# Altium schematic sheet 0.SchDoc
size A4
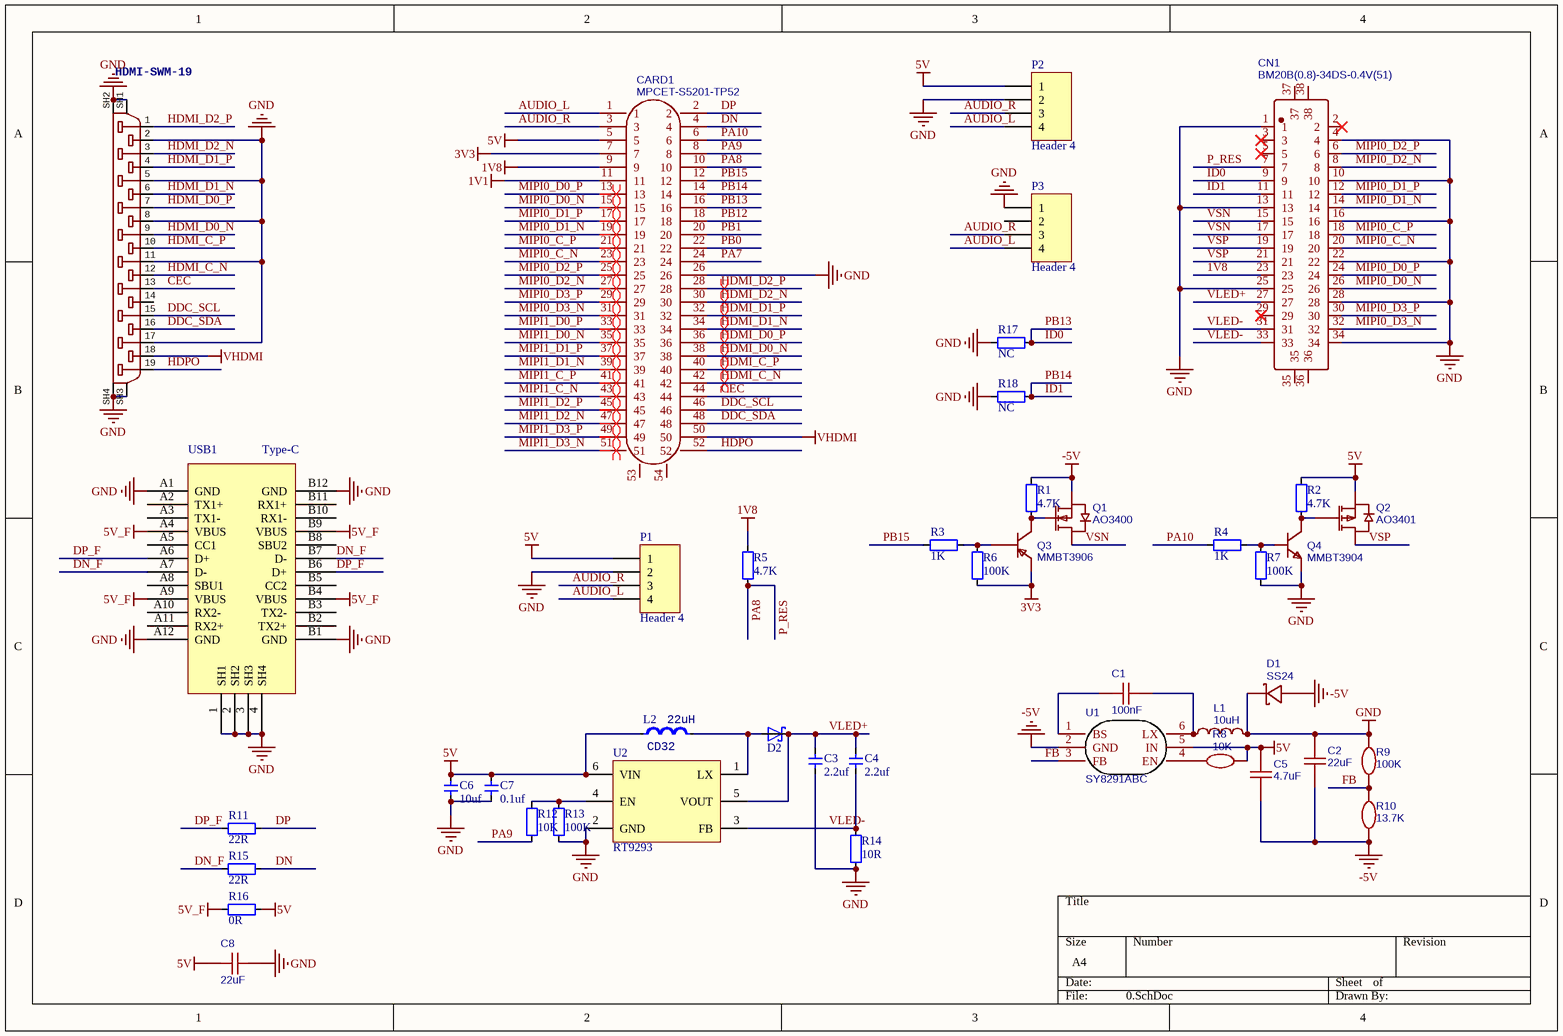
[diagram p0: 0.SchDoc]

## Parts
C1  100nF  [0603_CAP]
C2  22uF  [0603_CAP]
C3  2.2uf  [0603_CAP]
C4  2.2uf  [0603_CAP]
C5  4.7uF  [0603_CAP]
C6  10uf  [0603_CAP]
C7  0.1uf  [0603_CAP]
C8  22uF  [0603_CAP]
CARD1  MPCET-S5201-TP52  [MINI-PCIE-SMD_MPCET-S5201-TP40]
CN1  BM20B(0.8)-34DS-0.4V(51)  [CONN-SMD_34P-P0.40_BM20B-0.8-34DS-0.4V-51]
D1  SS24  [SMA_L4.4-W2.8-LS5.4-RD]
D2  RSX501L-20  [SOD-123F_L2.8-W1.8-LS3.7-RD]  (value not drawn)
HDMI?  HDMI-SWM-19  [HDMI-SWM-19]
L1  10uH  [IND-SMD_L4.5-W4.5_SMMS0420]
L2  value 22uH  [IND_CD32]  (hidden comment: CD32)
P1  Header 4  [HDR1X4]
P2  Header 4  [HDR1X4]
P3  Header 4  [PJ-320D 3.5]
Q1  AO3400  [SOT-23-3]
Q2  AO3401  [SOT-23-3]
Q3  MMBT3906  [SOT-23-3]
Q4  MMBT3904  [SOT-23-3]
R1  4.7K  [0603_RES]
R2  4.7K  [0603_RES]
R3  1K  [0603_RES]
R4  1K  [0603_RES]
R5  4.7K  [0603_RES]
R6  100K  [0603_RES]
R7  100K  [0603_RES]
R8  10K  [0603_RES]
R9  100K  [0603_RES]
R10  13.7K  [0603_RES]
R11  22R  [0603_RES]
R12  10K  [0603_RES]
R13  100K  [0603_RES]
R14  10R  [0603_RES]
R15  22R  [0603_RES]
R16  0R  [0603_RES]
R17  NC  [0603_RES]
R18  NC  [0603_RES]
U1  SY8291ABC  [SOT-23-6_L2.9-W1.6-P0.95-LS2.8-BR]
U2  RT9293  [SOT23-6]
USB1  Type-C  [Type-C-TOP]

## Nets
1V1: CARD1.11
1V8: CARD1.9 CN1.23 R5.1
3V3: CARD1.7 Q3.2(E) R6.1
5V: C5.1 C6.2 C7.2 C8.1 CARD1.5 L2.1 P1.1 P2.1 Q2.2(S) R2.2 R8.2 R16.2 U1.5(IN) U2.6(VIN)
5V_F: R16.1 USB1.A4(VBUS) USB1.A9(VBUS) USB1.B4(VBUS) USB1.B9(VBUS)
-5V: C2.2 C5.2 D1.2(A) Q1.2(S) R1.2 R10.1 U1.2(GND)
GND: C2.1 C3.1 C6.1 C7.1 C8.2 CARD1.26 CN1.1 CN1.4 CN1.10 CN1.13 CN1.16 CN1.22 CN1.25 CN1.28 CN1.34 D1.1(K) HDMI?.2 HDMI?.5 HDMI?.8 HDMI?.11 HDMI?.17 HDMI?.SH1 HDMI?.SH2 HDMI?.SH3 HDMI?.SH4 L1.2 P1.2 P2.2 P3.1 Q4.2(E) R7.1 R9.2 R13.2 R14.2 R17.2 R18.2 U2.2(GND) USB1.1(SH1) USB1.2(SH2) USB1.3(SH3) USB1.4(SH4) USB1.A1(GND) USB1.A12(GND) USB1.B1(GND) USB1.B12(GND)
VHDMI: CARD1.50 HDMI?.18
AUDIO_L: CARD1.1 P1.4 P2.4 P3.4
AUDIO_R: CARD1.3 P1.3 P2.3 P3.3
CEC: CARD1.44 HDMI?.13
DDC_SCL: CARD1.46 HDMI?.15
DDC_SDA: CARD1.48 HDMI?.16
DN: CARD1.4 R15.2
DN_F: R15.1 USB1.A7(D-) USB1.B7(D-)
DP: CARD1.2 R11.2
DP_F: R11.1 USB1.A6(D+) USB1.B6(D+)
FB: R9.1 R10.2 U1.3(FB)
HDMI_C_N: CARD1.42 HDMI?.12
HDMI_C_P: CARD1.40 HDMI?.10
HDMI_D0_N: CARD1.38 HDMI?.9
HDMI_D0_P: CARD1.36 HDMI?.7
HDMI_D1_N: CARD1.34 HDMI?.6
HDMI_D1_P: CARD1.32 HDMI?.4
HDMI_D2_N: CARD1.30 HDMI?.3
HDMI_D2_P: CARD1.28 HDMI?.1
HDPO: CARD1.52 HDMI?.19
ID0: CARD1.16 CN1.9 R17.1  [also labelled PB13]
ID1: CARD1.14 CN1.11 R18.1  [also labelled PB14]
MIPI0_C_N: CARD1.23 CN1.20
MIPI0_C_P: CARD1.21 CN1.18
MIPI0_D0_N: CARD1.15 CN1.26
MIPI0_D0_P: CARD1.13 CN1.24
MIPI0_D1_N: CARD1.19 CN1.14
MIPI0_D1_P: CARD1.17 CN1.12
MIPI0_D2_N: CARD1.27 CN1.8
MIPI0_D2_P: CARD1.25 CN1.6
MIPI0_D3_N: CARD1.31 CN1.32
MIPI0_D3_P: CARD1.29 CN1.30
MIPI1_C_N: CARD1.43
MIPI1_C_P: CARD1.41
MIPI1_D0_N: CARD1.35
MIPI1_D0_P: CARD1.33
MIPI1_D1_N: CARD1.39
MIPI1_D1_P: CARD1.37
MIPI1_D2_N: CARD1.47
MIPI1_D2_P: CARD1.45
MIPI1_D3_N: CARD1.51
MIPI1_D3_P: CARD1.49
P_RES: CARD1.10 CN1.7 R5.2  [also labelled PA8]
PA7: CARD1.24
PA9: CARD1.8 R12.2
PA10: CARD1.6 R4.2
PB0: CARD1.22
PB1: CARD1.20
PB12: CARD1.18
PB15: CARD1.12 R3.2
VLED+: C3.2 C4.2 CN1.27 D2.1 U2.5(VOUT)
VLED-: C4.1 CN1.31 CN1.33 R14.1 U2.3(FB)
VSN: CN1.15 CN1.17 Q1.3(D)
VSP: CN1.19 CN1.21 Q2.3(D)
NetC1_1: C1.1 L1.1 U1.6(LX)
NetC1_2: C1.2 U1.1(BS)
NetD2_2: D2.2 L2.2 U2.1(LX)
NetQ1_1: Q1.1(G) Q3.3(C) R1.1
NetQ2_1: Q2.1(G) Q4.3(C) R2.1
NetQ3_1: Q3.1(B) R3.1 R6.2
NetQ4_1: Q4.1(B) R4.1 R7.2
NetR8_1: R8.1 U1.4(EN)
NetR12_1: R12.1 R13.1 U2.4(EN)

Not connected (* = marked no-connect by the designer): CARD1 53 54; CN1 2* 3* 5* 29* 35 36 37 38; HDMI? 14; P3 2; USB1 A2(TX1+) A3(TX1-) A5(CC1) A8(SBU1) A10(RX2-) A11(RX2+) B2(TX2+) B3(TX2-) B5(CC2) B8(SBU2) B10(RX1-) B11(RX1+)

## Layout directives
differential pair: HDMI_C_N, HDMI_C_P, HDMI_D0_N, HDMI_D0_P, HDMI_D1_N, HDMI_D1_P, HDMI_D2_N, HDMI_D2_P, MIPI0_C_N, MIPI0_C_P, MIPI0_D0_N, MIPI0_D0_P, MIPI0_D1_N, MIPI0_D1_P, MIPI0_D2_N, MIPI0_D2_P, MIPI0_D3_N, MIPI0_D3_P, MIPI1_C_N, MIPI1_C_P, MIPI1_D0_N, MIPI1_D0_P, MIPI1_D1_N, MIPI1_D1_P, MIPI1_D2_N, MIPI1_D2_P, MIPI1_D3_N, MIPI1_D3_P

## Library data of the parts
C1 C2 C5 C8 = 0.1u: nameAlias: Value(F); Contributor: LCEDA_Lib; spicePre: C; spiceSymbolName: C_0603_US
C3 C4 C6 C7 = 电容-0402: Capacitor; Value: 0.1u
CARD1 = MPCET-S5201-TP52: BOM_Manufacturer: Argosy Research Inc.; Contributor: LCSC; BOM_Supplier: LCSC; BOM_Supplier Part: C367018; BOM_Manufacturer Part: MPCET-S5201-TP52; spicePre: C; spiceSymbolName: MPCET-S5201-TP52
CN1 = BM20B(0.8)-34DS-0.4V(51): BOM_Manufacturer: HRS(Hirose); Contributor: LCSC; BOM_Supplier: LCSC; BOM_Supplier Part: C424541; BOM_Manufacturer Part: BM20B(0.8)-34DS-0.4V(51); spicePre: C; spiceSymbolName: BM20B(0.8)-34DS-0.4V(51)
D1 = SS24_C181203: BOM_Manufacturer: Hottech; Contributor: LCSC; BOM_Paste Type: expand; BOM_Supplier: LCSC; BOM_Manufacturer Part: SS24; BOM_Supplier Part: C181203; spicePre: D; spiceSymbolName: SS24_C181203
D2 = RSX501L-20: Diode Schottky 40V 1A Surface Mount SMA _DO-214AC_; MP: SS14; MF: ON Semiconductor; Package: DO-214AC-214 ON Semiconductor; Value: *; Availability: Unavailable; Price: None; SnapEDA_Link: https://www.snapeda.com/parts/SS14/ON%20Semiconductor/view-part/1413348/?ref=snap
HDMI? = HDMI-MC34931HDMI-SWM-19
L1 = 10uH: BOM_Manufacturer: SXN; BOM_Manufacturer Part: SMMS0420-100M; nameAlias: Inductance; BOM_Paste Type: recommend; BOM_Supplier: LCSC; BOM_Supplier Part: C133195; spicePre: L; spiceSymbolName: SMMS0420-100M
L2 = Ind_CD32: Inductor; Specification: ±5% 100mA; Manufacturer: *; Type: CD32
P1-P3 = Header 4: Header, 4-Pin; LatestRevisionDate: 17-Jul-2002; LatestRevisionNote: Re-released for DXP Platform.; Publisher: Altium Limited
Q1 = AO3400_C841146: BOM_Manufacturer: LGE; Contributor: LCSC; BOM_Supplier: LCSC; BOM_Supplier Part: C841146; BOM_Manufacturer Part: AO3400; BOM_JLCPCB Part Class: Extended Part; spicePre: Q; spiceSymbolName: AO3400_C841146
Q2 = AO3401_C688915: BOM_Manufacturer: LGE; Contributor: LCSC; BOM_Supplier: LCSC; BOM_Supplier Part: C688915; BOM_Manufacturer Part: AO3401; BOM_JLCPCB Part Class: Extended Part; spicePre: Q; spiceSymbolName: AO3401_C688915
Q3 = MMBT3906_C2833292: BOM_Manufacturer: 晶导微电子; Contributor: LCSC; BOM_Supplier: LCSC; BOM_Supplier Part: C2833292; BOM_Manufacturer Part: MMBT3906; spicePre: Q; spiceSymbolName: MMBT3906_C2833292
Q4 = MMBT3904_C2762221: BOM_Manufacturer: 晶导微电子; Contributor: LCSC; BOM_Supplier: LCSC; BOM_Supplier Part: C2762221; BOM_Manufacturer Part: MMBT3904; BOM_JLCPCB Part Class: Extended Part; spicePre: Q; spiceSymbolName: MMBT3904_C2762221
R1-R7 R12-R14 R16-R18 = 电阻-0402: Resistor; Value: 22R
R8-R10 = 1k: nameAlias: Value(Ω); Contributor: LCEDA_Lib; spicePre: R; spiceSymbolName: R_0603_EU
R11 R15 = 电阻-0402: Resistor; Value: 22R
U1 = SY8291ABC: BOM_Manufacturer: Silergy; SMT Type: Extend; BOM_Supplier: LCSC; BOM_Manufacturer Part: SY8291ABC; BOM_Supplier Part: C125896; BOM_LCSC Assembly: Yes; spicePre: U; spiceSymbolName: SY8291ABC
U2 = RT9293: LCD-LED Driver
USB1 = USB-Type-C-TOP